# Altium schematic sheet DriveMoteur.SchDoc
size Letter; Organization: Cegep Limoilou; Address1: 1300, 8e Avenue; Address2: Québec, QC; Address3: Canada; Address4: G1J 5L5; Revision: Enseignants; SheetNumber: 3; SheetTotal: 8; Conception: Ilyes Gharmoul; Titre: Drive Moteur; Modification: Ilyes G
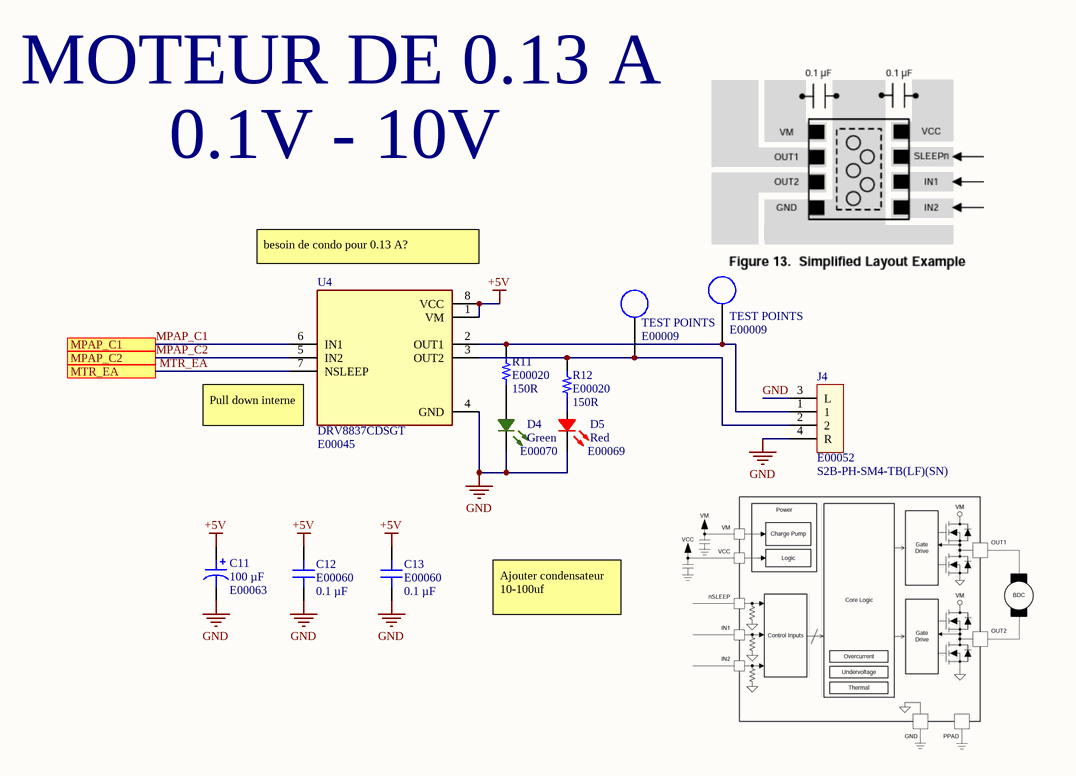
[diagram p0: DriveMoteur.SchDoc]

## Parts
C11  100 µF  ADAM Inventory Number 1: E00063  [CAP ALSMD ELEC 8.3MM H10.5MM]
C12  ADAM Inventory Number 1: E00060  [CAP 0603]  (hidden comment: 0.1 µF)
C13  ADAM Inventory Number 1: E00060  [CAP 0603]  (hidden comment: 0.1 µF)
D4  Green  ADAM Inventory Number 1: E00070  [Green LED 0603]
D5  Red  ADAM Inventory Number 1: E00069  [Red Led 0603]
J4  ADAM Inventory Number 1: E00052  Supplier Part Number 1: S2B-PH-SM4-TB(LF)(SN)  [S2B-PH-SM4-TB_LF__SN]  (hidden comment: CONN JST 2P SM 90DEG)
M+  TEST POINTS  ADAM Inventory Number 1: E00009  [TEST POINTS]
M-  TEST POINTS  ADAM Inventory Number 1: E00009  [TEST POINTS]
R11  ADAM Inventory Number 1: E00020  [RES 0603]  (hidden comment: 150R)
R12  ADAM Inventory Number 1: E00020  [RES 0603]  (hidden comment: 150R)
U4  DRV8837CDSGT  ADAM Inventory Number 1: E00045  [DRV8837CDSGT]

## Ports
MPAP_C1, MPAP_C2, MTR_EA

## Nets
+5V: C11.1 C12.2 C13.2 U4.1(VM) U4.8(VCC)
GND: C11.2 C12.1 C13.1 D4.2 D5.2 J4.3(L) J4.4(R) U4.4(GND)
MPAP_C1: U4.6(IN1) ; port MPAP_C1
MPAP_C2: U4.5(IN2) ; port MPAP_C2
MTR_EA: U4.7(NSLEEP) ; port MTR_EA
NetD4_1: D4.1 R11.1
NetD5_1: D5.1 R12.1
NetJ4_1: J4.1 M+.1 R11.2 U4.2(OUT1)
NetJ4_2: J4.2 M-.1 R12.2 U4.3(OUT2)

## Notes on the sheet
- MOTEUR DE 0.13 A
- 0.1V - 10V
- (near U4) besoin de condo pour 0.13 A?
- (near U4) Pull down interne
- Ajouter condensateur 10-100uf
- Titre :
- Conception :
- Date :
- Modification :
- Heure :
- Révision :
- Feuille
- de
- Fichier :

## Library data of the parts
C11 = CAP ALUM 100UF 20% 50V SMD: Manufacturer Part Number 1: UWT1H101MNL1GS; manufacturer: Nichicon; Lifetime @ Temp.: 1000 Hrs @ 105°C; Polarization: Polar; Ripple Current @ High Frequency: 210 mA @ 10 kHz; Ripple Current @ Low Frequency: 140 mA @ 120 Hz; Surface Mount Land Size: 0.327" L x 0.327" W (8.30mm x 8.30mm); Applications: General Purpose; Capacitance: 100 µF; componentlink1description: Datasheet; componentlink1url: https://products.nichicon.co.jp/en/pdf/XJA043/e-uwt.pdf; componentlink2description: DigiKey Link; componentlink2url: https://www.digikey.com/en/products/detail/nichicon/UWT1H101MNL1GS/589967; Device Package: Radial, Can - SMD; Height - Seated (Max): 0.413" (10.50mm); lastupdated: 2023-04-08 20:11:02; Lifecycle Status: Active; Minimum Order: 1; Mounting Type: Surface Mount; Operating Temperature: -55°C ~ 105°C; Package / Case: Radial, Can - SMD; packaging: TapeAndReel; partid: 7453; Part Status: Active; price: 0.11; series: UWT; Size / Dimension: 0.315" Dia (8.00mm); Supplier 1: DigiKey; Supplier Part Number 1: 493-2226-1-ND; Tolerance: ±20%; value: 100 µF; Voltage - Rated: 50 V
C12 C13 = CAP CER 0.1UF 50V X7R 0603: Manufacturer Part Number 1: C0603C104K5RAC7411; manufacturer: KEMET; Tolerance: ±10%; Applications: Bypass, Decoupling; Capacitance: 0.1 µF; componentlink1description: Datasheet; componentlink1url: https://api.kemet.com/component-edge/download/datasheet/C0603C104K5RAC7411.pdf; componentlink2description: DigiKey Link; componentlink2url: https://www.digikey.com/en/products/detail/kemet/C0603C104K5RAC7411/3317013; Device Package: 0603 (1608 Metric); lastupdated: 2023-03-28 19:09:05; Lifecycle Status: Active; Minimum Order: 1; Mounting Type: Surface Mount, MLCC; Operating Temperature: -55°C ~ 125°C; Package / Case: 0603 (1608 Metric); packaging: TapeAndReel; partid: 2233; Part Status: Active; price: 0.01; series: SMD Comm X7R; Size / Dimension: 0.063" L x 0.031" W (1.60mm x 0.80mm); Supplier 1: DigiKey; Supplier Part Number 1: 399-C0603C104K5RAC7411CT-ND; Temperature Coefficient: X7R; Thickness (Max): 0.035" (0.90mm); Voltage - Rated: 50V; Value: 0.1 µF
D4 = 0603 GREEN LED: LED GREEN 0603 SMD; Manufacturer Part Number 1: 5973316507F; Manufacturer: Dialight; Configuration: Standard; Current - Test: 20mA; Lens Color: 1.24mm; Lens Style: Round with Domed Top; Millicandela Rating: 34mcd; Voltage - Forward (Vf) (Typ): 2V; Wavelength - Dominant: 560nm; Color: Green; ComponentLink1Description: Datasheet; ComponentLink1URL: http://www.dialightsignalsandcomponents.com/Assets/Drawings/2D_Drawings_DrawingDetailedSpec/NewDrawings/C18371C.pdf; ComponentLink2Description: DigiKey Link; ComponentLink2URL: https://www.digikey.com/en/products/detail/dialight/5973316507F/9385428; Device Package: 0603 (1608 Metric); Height (Max): 1.24mm; LastUpdated: 2023-03-27 19:52:49; Lifecycle Status: Active; Minimum Order: 1; Mounting Type: Surface Mount; Package / Case: 0603 (1608 Metric); Packaging: TapeAndReel; PartId: 587; Part Status: Active; Price: 0.13; Series: 597; Size / Dimension: 1.60mm L x 0.80mm W; Supplier 1: DigiKey; Supplier Part Number 1: 350-4373-1-ND; Supplier Device Package: 0603; Value: Green
D5 = 0603 RED LED: Manufacturer Part Number 1: BL-HUB36A-AV-TRB; Manufacturer: American Bright Optoelectronics Corporation; Configuration: Standard; Current - Test: 20mA; Lens Color: Colorless; Lens Style: Rectangle with Flat Top; Lens Transparency: Clear; Millicandela Rating: 94mcd; Viewing Angle: 120°; Voltage - Forward (Vf) (Typ): 2.2V; Wavelength - Dominant: 632nm; Wavelength - Peak: 645nm; Color: Red; ComponentLink1Description: Datasheet; ComponentLink1URL: https://americanbrightled.com/pdffiles/smt/BL-HUB36A-AV-TRB.pdf; ComponentLink2Description: DigiKey Link; ComponentLink2URL: https://www.digikey.com/en/products/detail/american-bright-optoelectronics-corporation/BL-HUB36A-AV-TRB/9678174; Device Package: 0603 (1608 Metric); Height (Max): 0.70mm; LastUpdated: 2023-03-27 19:53:19; Lifecycle Status: Active; Minimum Order: 1; Mounting Type: Surface Mount; Package / Case: 0603 (1608 Metric); Packaging: TapeAndReel; PartId: 1020; Part Status: Active; Price: 0.04; Series: -; Size / Dimension: 1.60mm L x 0.80mm W; Supplier 1: DigiKey; Supplier Part Number 1: BL-HUB36A-AV-TRBCT-ND; Supplier Device Package: 0603; Value: Red
J4 = CONN JST 2P SM 90DEG: CONN SM JST 2P; Copyright: Copyright (C) 2023 Ultra Librarian. All rights reserved.; Mfr_Name: JST; Manufacturer Part Number 1: S2B-PH-SM4-TB(LF)(SN); RefDes: RefDes; Type: DEV; Supplier 1: Arrow Electronics; Parameter 1: *
M+ M- = TEST POINTS: RCWCTE TEST POINTS; Manufacturer Part Number 1: RCWCTE
R11 R12 = RES SMD 150 OHM: RES SMD 150 OHM 0.1% 1/8W 0603; Manufacturer Part Number 1: RC0603FR-07150RL; Manufacturer: Vishay Beyschlag; Power (Watts): 0.125W, 1/8W; Temperature Coefficient: ±25ppm/°C; ComponentLink1Description: Datasheet; ComponentLink1URL: http://www.vishay.com/docs/28785/mcat_pre.pdf; ComponentLink2Description: DigiKey Link; ComponentLink2URL: http://digikey.com/product-detail/en/vishay-beyschlag/MCT0603MD1500BP100/MCT0603-150-MBCT-ND/2092134; Composition: Thin Film; Device Package: 0603 (1608 Metric); Features: Anti-Sulfur, Automotive AEC-Q200; Height - Seated (Max): 0.022" (0.55mm); LastUpdated: 2023-04-04 19:29:46; Lifecycle Status: Active; Minimum Order: 1; Number of Terminations: 2; Operating Temperature: -55°C ~ 155°C; Package / Case: 0603 (1608 Metric); Packaging: TapeAndReel; PartId: 5246; Part Status: Active; Price: 0.23; Ratings: AEC-Q200; Resistance: 150R; Series: MCT AT - Precision; Size / Dimension: 0.061" L x 0.033" W (1.55mm x 0.85mm); Supplier Device Package: 0603; Tolerance: ±0.1%; Supplier 1: Future Electronics; Supplier Part Number 1: 1201284; Value: 150R
U4 = DRV8837CDSGT: Motor Driver NMOS PWM 8-WSON (2x2); Supplier 1: Digi-Key; Supplier Part Number 1: 296-44747-1-ND; Manufacturer Part Number 1: DRV8837CDSGT